# EAGLE schematic SmartCellPrototype (EAGLE 7.1.0)
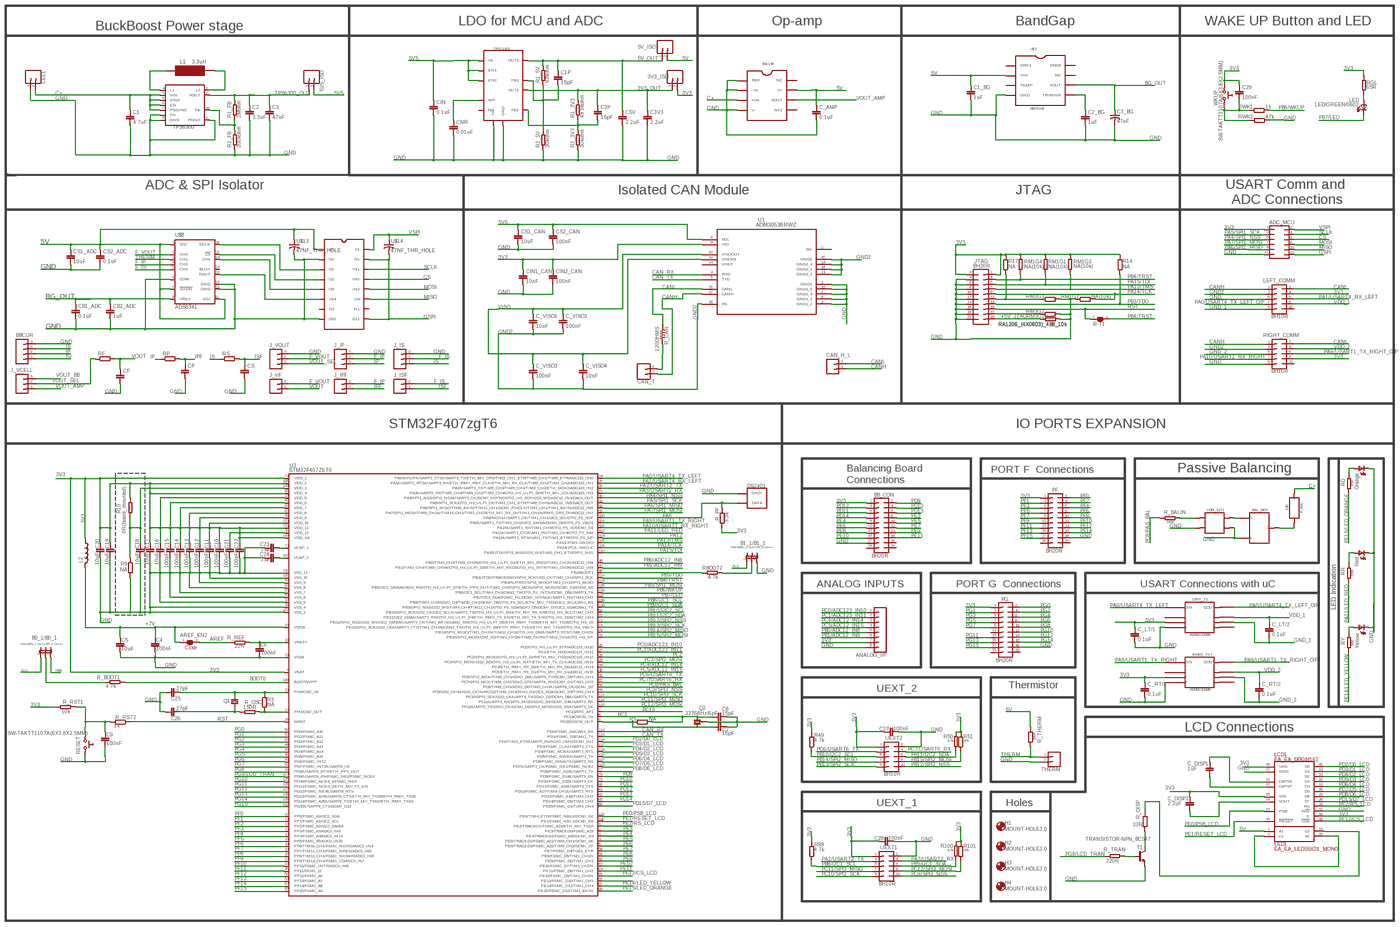
[diagram p0: schematic, sheet 1, overview]
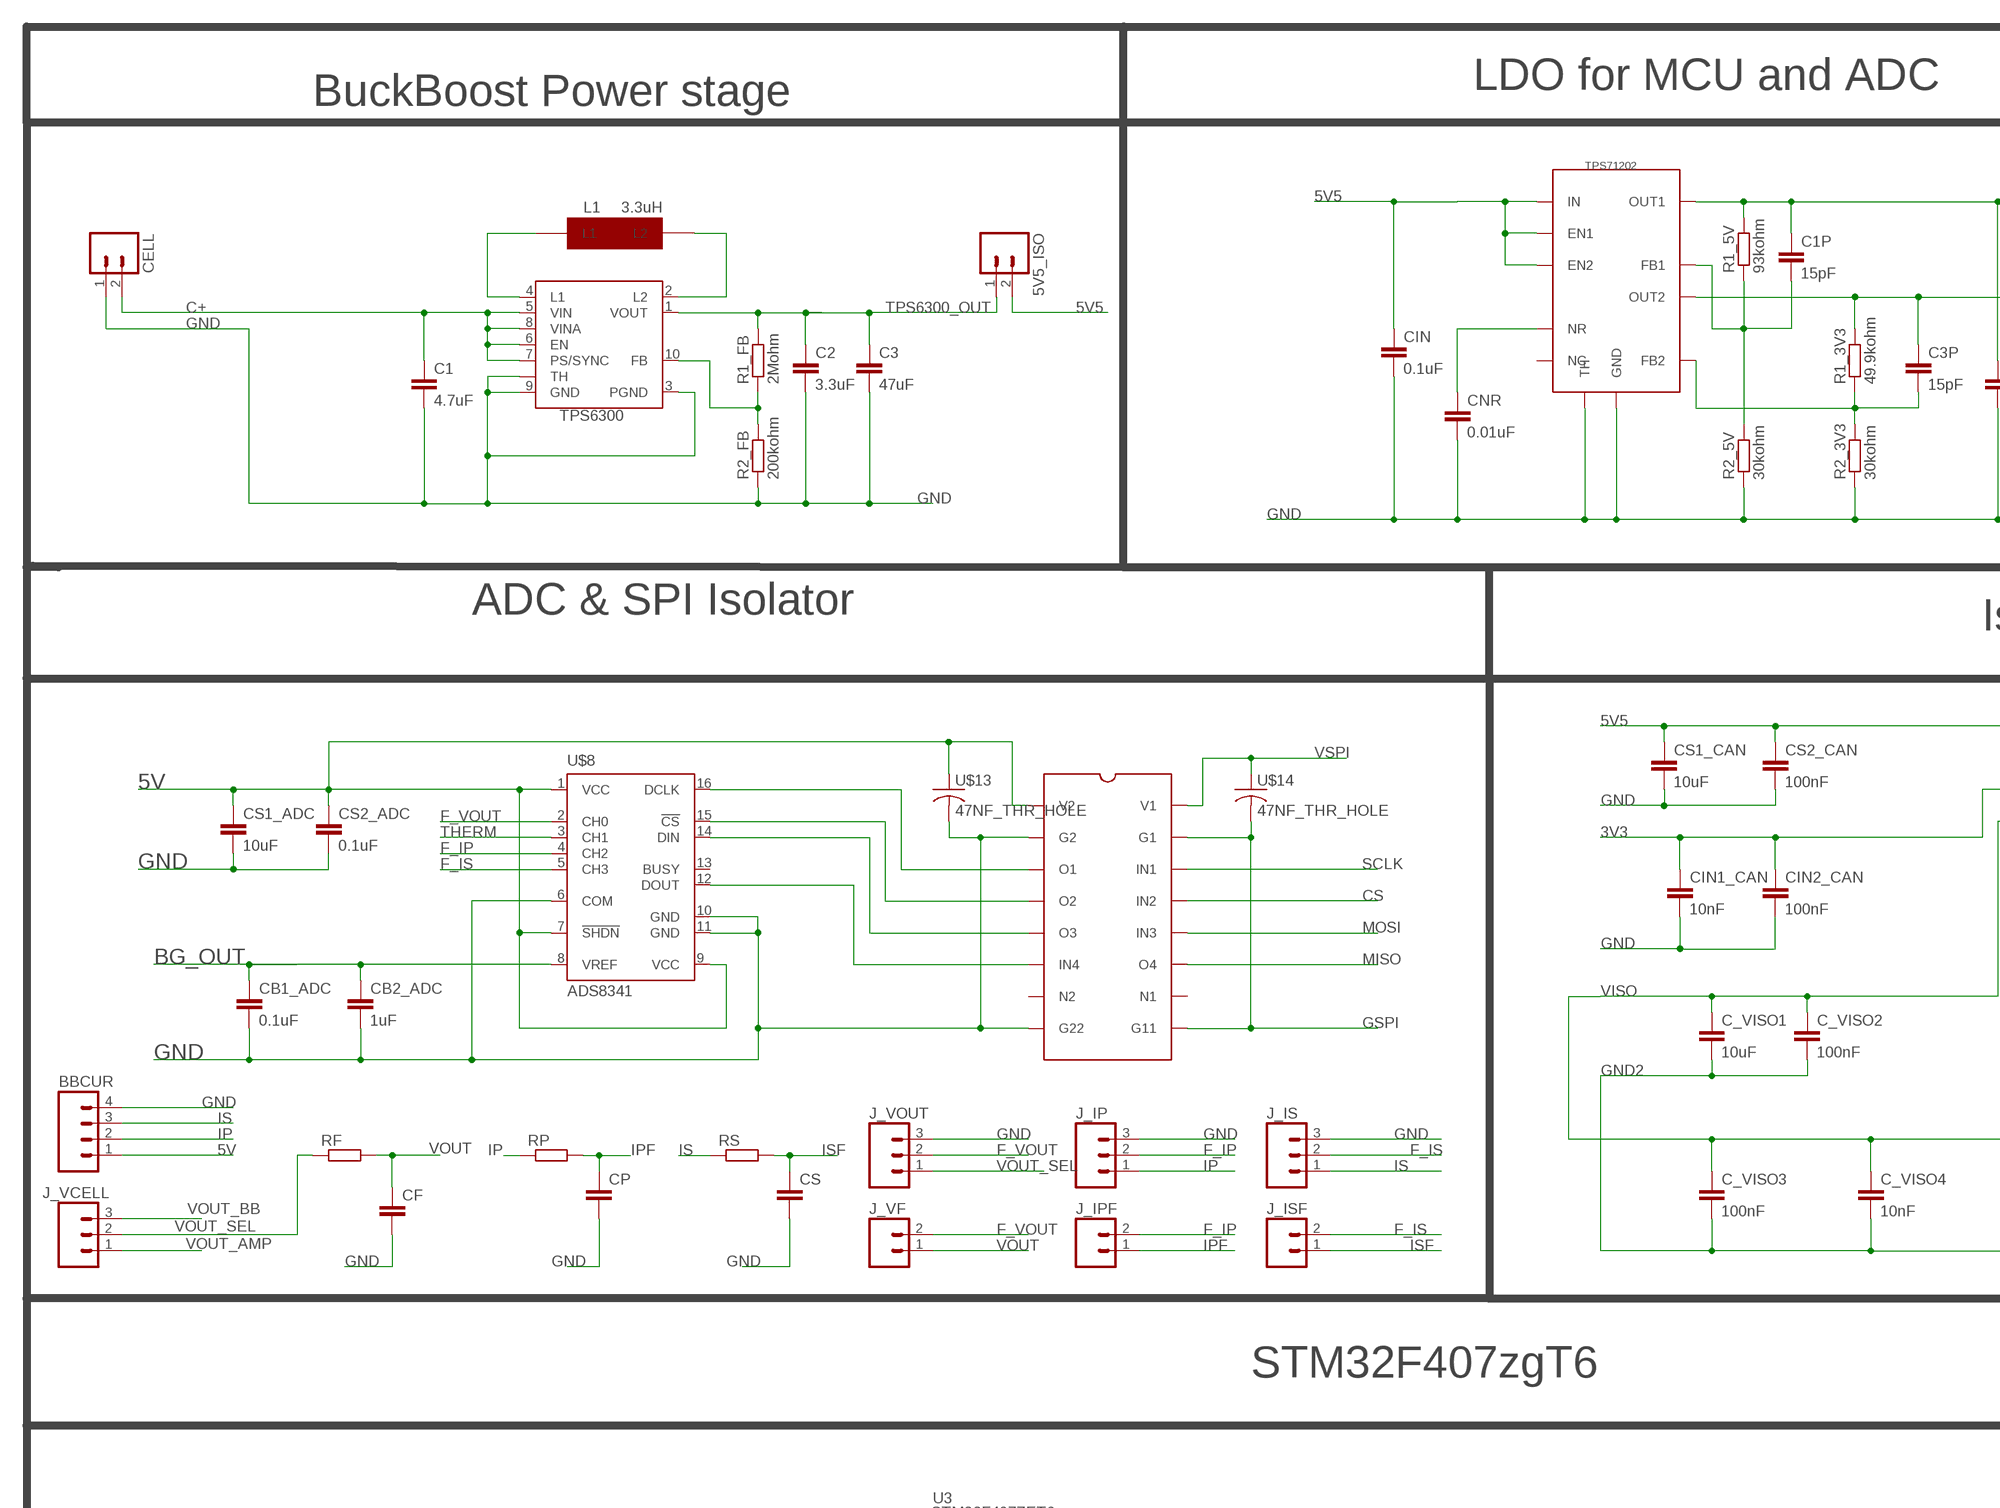
[diagram p1: schematic, sheet 1, part 1 of 4]
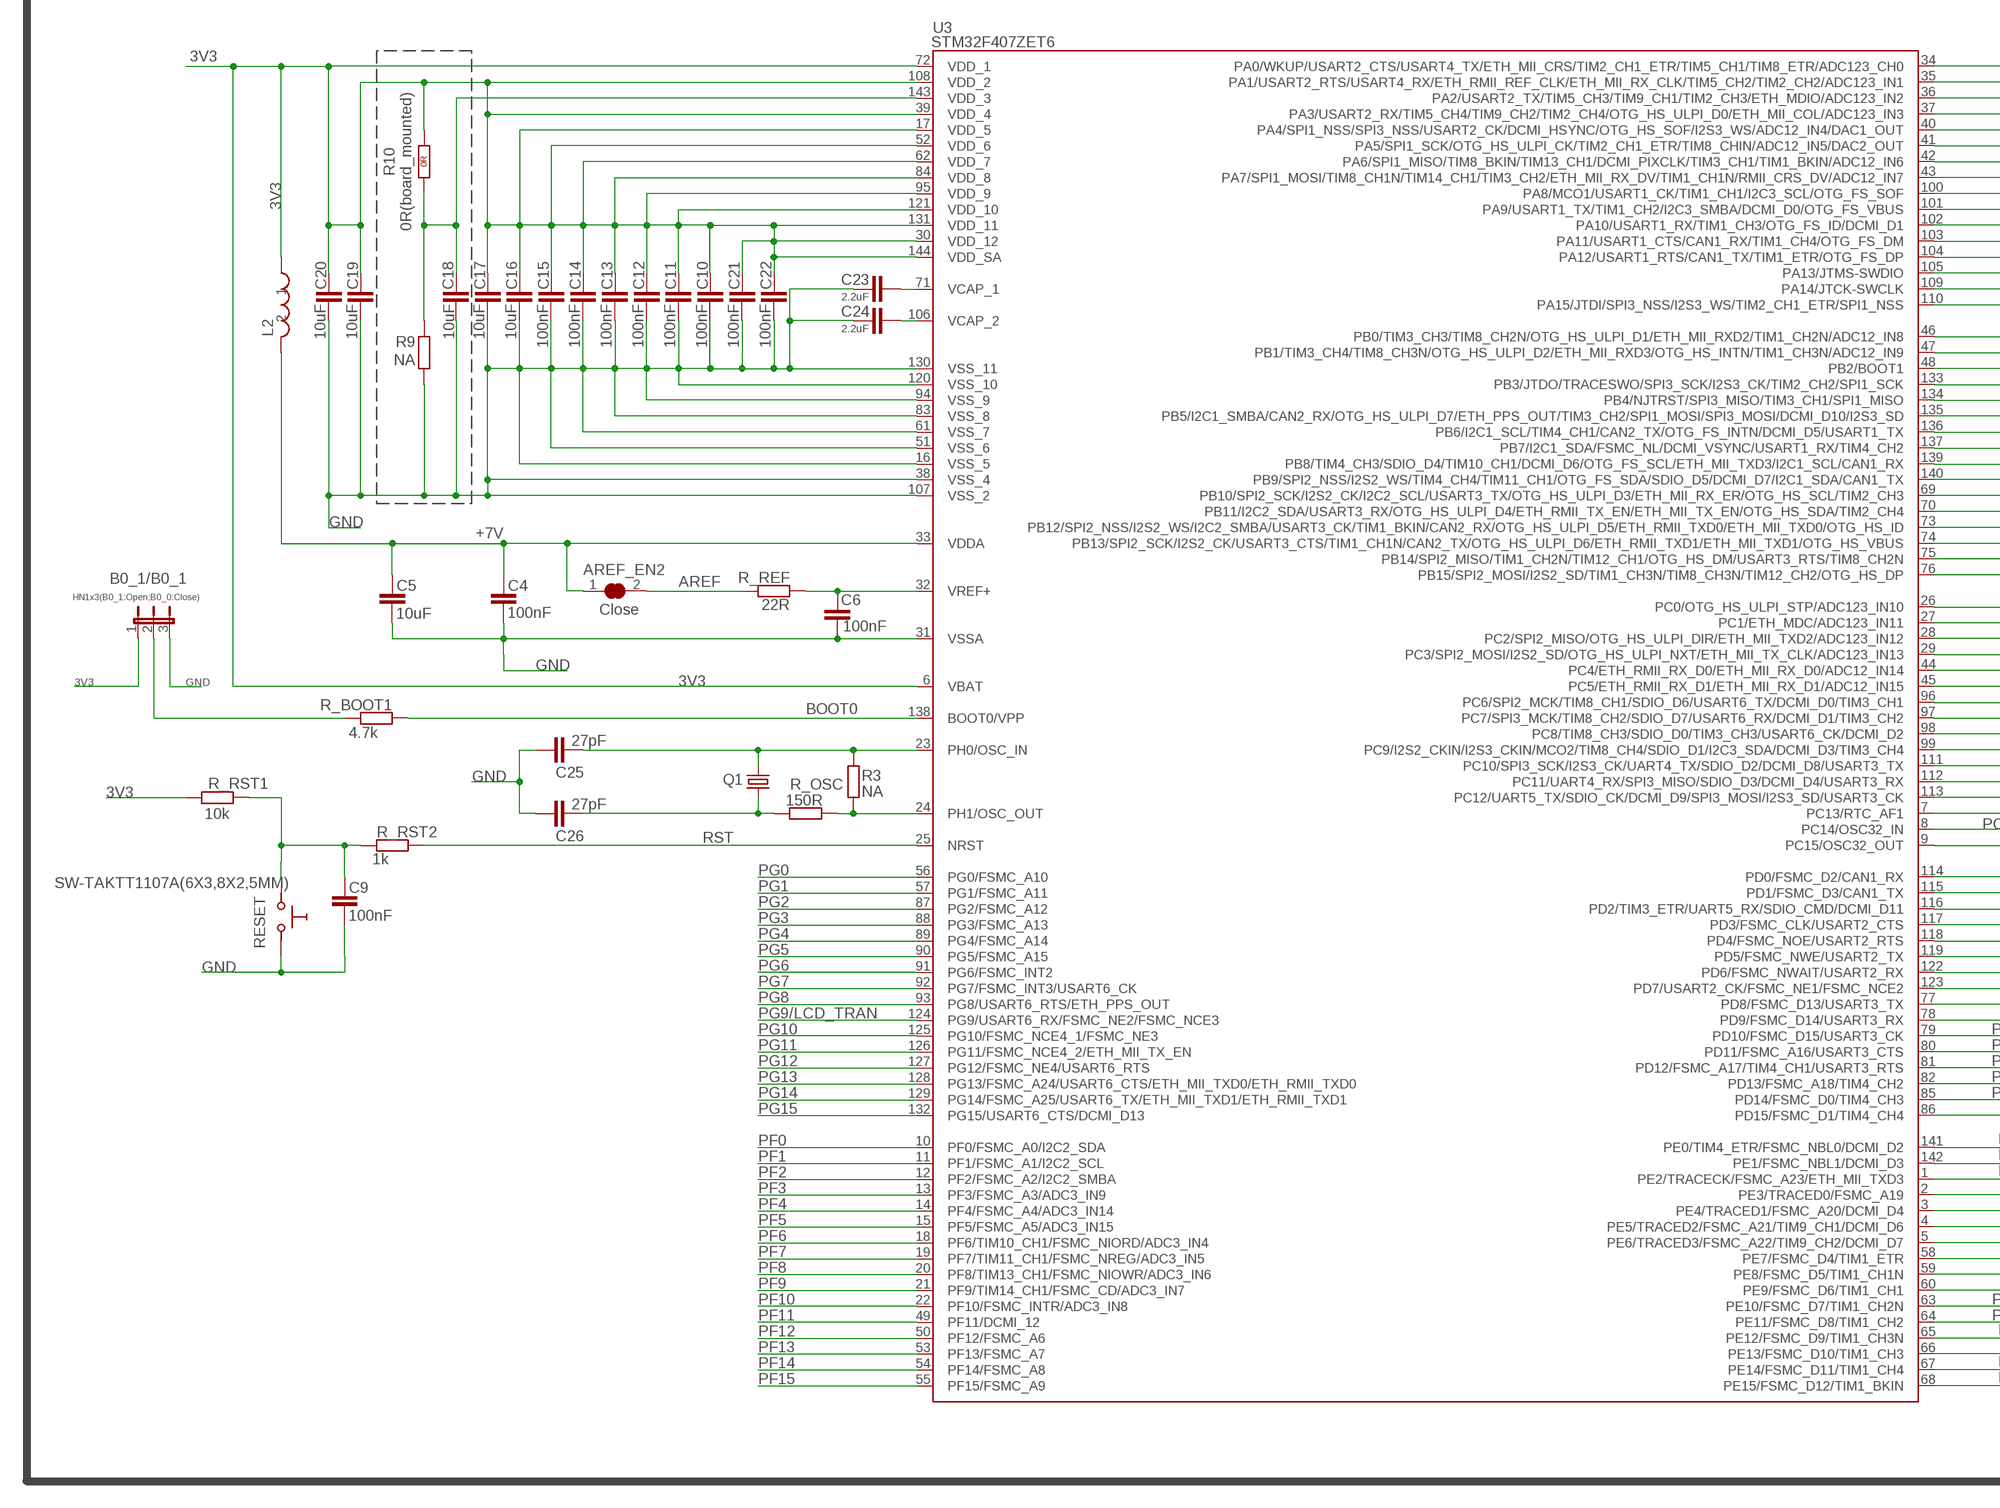
[diagram p2: schematic, sheet 1, part 2 of 4]
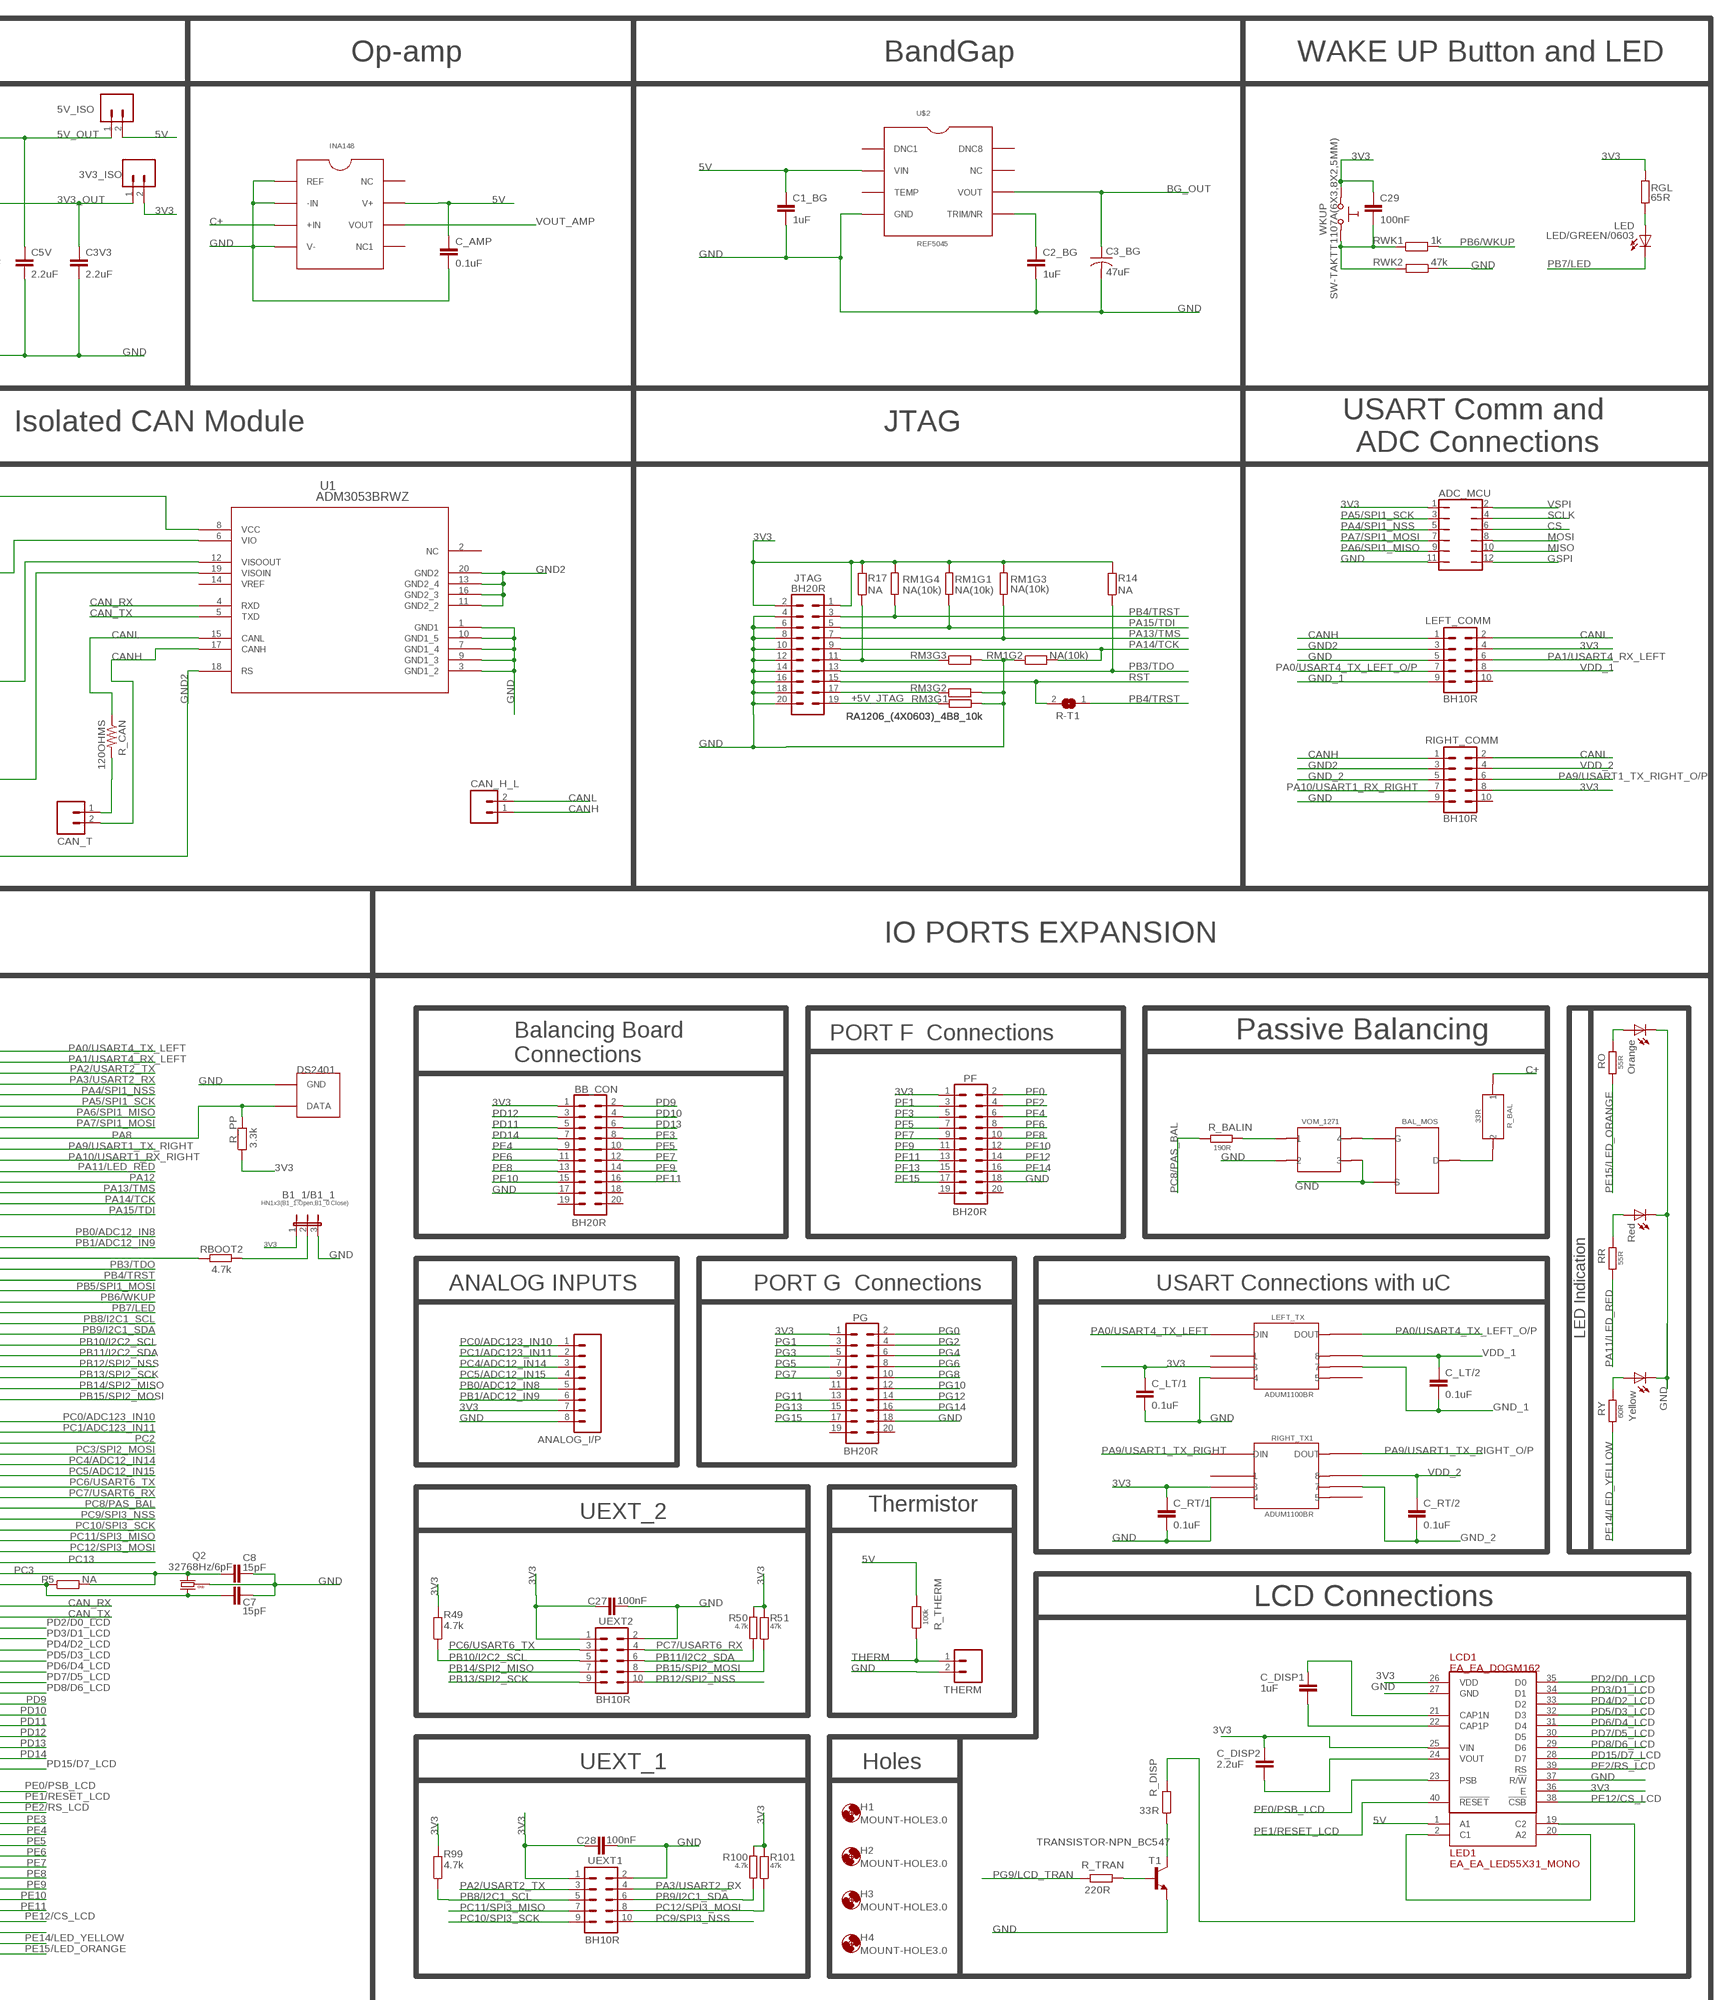
[diagram p3: schematic, sheet 1, part 3 of 4]
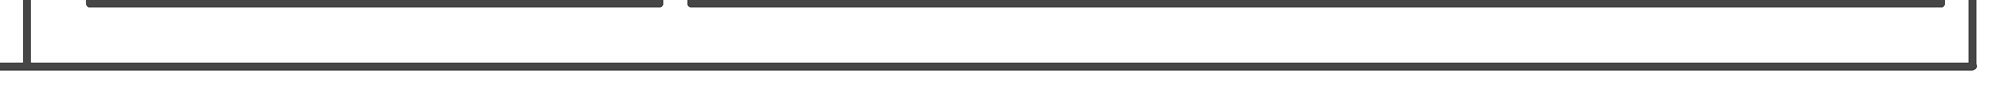
[diagram p4: schematic, sheet 1, part 4 of 4]

## Parts
3V3_ISO  M02PTH  [1X02]
5V5_ISO  M02PTH  [1X02]
5V_ISO  M02PTH  [1X02]
ADC_MCU  JP6Q  [JP6Q]
ANALOG_I/P  M081X08  [1X08]
AREF_EN2  Close  SJSJ_1_SMALLER_CLOSE  [SJ_1_SMALLER_CLOSE]
B0_1/B0_1  HN1x3(B0_1:Open;B0_0:Close)  JP2E  [JP2]
B1_1/B1_1  HN1x3(B1_1:Open;B1_0:Close)  JP2E  [JP2]
BAL_MOS  BAL_MOS  [BAL_MOS]
BB_CON  BH20R  ML20R  [BH20R]
BBCUR  M04PTH  [1X04]
C1  4.7uF  C-EUC0603  [C0603]
C1_BG  1uF  C-EUC0603  [C0603]
C1P  15pF  C-EUC0603  [C0603]
C2  3.3uF  C-EUC0603  [C0603]
C2_BG  1uF  C-EUC0603  [C0603]
C3  47uF  C-EUC0805  [C0805]
C3_BG  47uF  C3_BG  [C3_BG]
C3P  15pF  C-EUC0603  [C0603]
C3V3  2.2uF  C-EUC0603  [C0603]
C4  100nF  C-EUC0603  [C0603]
C5  10uF  C-EUC0603  [C0603]
C5V  2.2uF  C-EUC0603  [C0603]
C6  100nF  C-EUC0603  [C0603]
C7  15pF  C-EUC0603  [C0603]
C8  15pF  C-EUC0603  [C0603]
C9  100nF  C-EUC0603  [C0603]
C10  100nF  C-EUC0603  [C0603]
C11  100nF  C-EUC0603  [C0603]
C12  100nF  C-EUC0603  [C0603]
C13  100nF  C-EUC0603  [C0603]
C14  100nF  C-EUC0603  [C0603]
C15  100nF  C-EUC0603  [C0603]
C16  10uF  C-EUC0603  [C0603]
C17  10uF  C-EUC0603  [C0603]
C18  10uF  C-EUC0603  [C0603]
C19  10uF  C-EUC0603  [C0603]
C20  10uF  C-EUC0603  [C0603]
C21  100nF  C-EUC0603  [C0603]
C22  100nF  C-EUC0603  [C0603]
C23  2.2uF  C-EUC0603  [C0603]
C24  2.2uF  C-EUC0603  [C0603]
C25  27pF  C-EUC0603  [C0603]
C26  27pF  C-EUC0603  [C0603]
C27  100nF  C-EUC0603  [C0603]
C28  100nF  C-EUC0603  [C0603]
C29  100nF  C-EUC0805  [C0805]
C_AMP  0.1uF  C-EUC0603  [C0603]
C_DISP1  1uF  C-EUC0603  [C0603]
C_DISP2  2.2uF  C-EUC0603  [C0603]
C_LT/1  0.1uF  C-EUC0603  [C0603]
C_LT/2  0.1uF  C-EUC0603  [C0603]
C_RT/1  0.1uF  C-EUC0603  [C0603]
C_RT/2  0.1uF  C-EUC0603  [C0603]
C_VISO1  10uF  C-EUC0603  [C0603]
C_VISO2  100nF  C-EUC0603  [C0603]
C_VISO3  100nF  C-EUC0603  [C0603]
C_VISO4  10nF  C-EUC0603  [C0603]
CAN_H_L  M02PTH  [1X02]
CAN_T  M02PTH  [1X02]
CB1_ADC  0.1uF  C-EUC0603  [C0603]
CB2_ADC  1uF  C-EUC0603  [C0603]
CELL  M023.5MM  [SCREWTERMINAL-3.5MM-2]
CF  C-EUC0603  [C0603]
CIN  0.1uF  C-EUC0603  [C0603]
CIN1_CAN  10nF  C-EUC0603  [C0603]
CIN2_CAN  100nF  C-EUC0603  [C0603]
CNR  0.01uF  C-EUC0603  [C0603]
CP  C-EUC0603  [C0603]
CS  C-EUC0603  [C0603]
CS1_ADC  10uF  C-EUC0603  [C0603]
CS1_CAN  10uF  C-EUC0603  [C0603]
CS2_ADC  0.1uF  C-EUC0603  [C0603]
CS2_CAN  100nF  C-EUC0603  [C0603]
DS2401  DS2401  [DS2401]
H1  MOUNT-HOLE3.0  [3,0]
H2  MOUNT-HOLE3.0  [3,0]
H3  MOUNT-HOLE3.0  [3,0]
H4  MOUNT-HOLE3.0  [3,0]
HCPL092J-00E  HCPL902  [HCPL902]
IC1  TPS6300  [DRC-S-PVSON-N10]
INA148  INA148  [INA148]
J_IP  M03PTH  [1X03]
J_IPF  M02PTH  [1X02]
J_IS  M03PTH  [1X03]
J_ISF  M02PTH  [1X02]
J_VCELL  M03PTH  [1X03]
J_VF  M02PTH  [1X02]
J_VOUT  M03PTH  [1X03]
JTAG  BH20R  ML20R  [BH20R]
L1  3.3uH  IND_COILCRAFT3.3UH  [IND_COILCRAFT3.3UH]
L2  FERRITE_BEAD  [FERRITE_BEAD]
LCD1  EA_EA_DOGM162  [EA_EA_DOGM]
LED  LED/GREEN/0603  LED0603DWS  [LED-0603]
LED1  EA_EA_LED55X31_MONO  [EA_EA_LED55X31]
LEFT_COMM  BH10R  ML10R  [BH10R]
LEFT_TX  ADUM1100BR  [R_8]
PF  BH20R  ML20R  [BH20R]
PG  BH20R  ML20R  [BH20R]
Q1  HC49/S2  [HC49/SMD2]
Q2  32768Hz/6pF  Q_GND1  [TC26H_3_REPAIR_SMD]
R1_3V3  49.9kohm  R-EU_R0603  [R0603]
R1_5V  93kohm  R-EU_R0603  [R0603]
R1_FB  2Mohm  R-EU_R0603  [R0603]
R2_3V3  30kohm  R-EU_R0603  [R0603]
R2_5V  30kohm  R-EU_R0603  [R0603]
R2_FB  200kohm  R-EU_R0603  [R0603]
R3  NA  R-EU_R0603  [R0603]
R5  NA  R-EU_R0603  [R0603]
R9  NA  R-EU_R0603  [R0603]
R10  0R(board_mounted)  R_0R0R(NA)  [0603_0R]
R14  NA  R-EU_R0603  [R0603]
R17  NA  R-EU_R0603  [R0603]
R49  4.7k  R-EU_R0603  [R0603]
R50  4.7k  R-EU_R0603  [R0603]
R51  47k  R-EU_R0603  [R0603]
R99  4.7k  R-EU_R0603  [R0603]
R100  4.7k  R-EU_R0603  [R0603]
R101  47k  R-EU_R0603  [R0603]
R-T1  Open  SJSJ_SMALLER  [SJ_1_SMALLER]
R_BAL  33R  R_BAL  [R_BAL]
R_BALIN  190R  R-EU_R0603  [R0603]
R_BOOT1  4.7k  R-EU_R0603  [R0603]
R_CAN  120OHMS  [120OHM]
R_DISP  33R  R-EU_R0603  [R0603]
R_OSC  150R  R-EU_R0603  [R0603]
R_PP  3.3k  R-EU_R0603  [R0603]
R_REF  22R  R-EU_R0603  [R0603]
R_RST1  10k  R-EU_R0603  [R0603]
R_RST2  1k  R-EU_R0603  [R0603]
R_THERM  100k  R-EU_R0603  [R0603]
R_TRAN  220R  R-EU_R0603  [R0603]
RBOOT2  4.7k  R-EU_R0603  [R0603]
RESET  SW-TAKTT1107A(6X3,8X2,5MM)  [WS-TAKT_6X3.5_SMD_NOCREAM]
RF  R-EU_R0603  [R0603]
RGL  65R  R-EU_R0603_5MIL_DWS  [R0603_5MIL_DWS]
RIGHT_COMM  BH10R  ML10R  [BH10R]
RIGHT_TX1  ADUM1100BR  [R_8]
RM1  NA(10k)  R_MATRIX_4E  [R_MATRIX_4]
RM3  RA1206_(4X0603)_4B8_10k  R_MATRIX_4E  [R_MATRIX_4]
RO  55R  R-EU_R0603  [R0603]
RP  R-EU_R0603  [R0603]
RR  55R  R-EU_R0603  [R0603]
RS  R-EU_R0603  [R0603]
RWK1  1k  R-EU_R0603_5MIL_DWS  [R0603_5MIL_DWS]
RWK2  47k  R-EU_R0603_5MIL_DWS  [R0603_5MIL_DWS]
RY  60R  R-EU_R0603  [R0603]
T1  TRANSISTOR-NPN_BC547  [TRANSISTOR-NPN_TO92]
THERM  M02JST-PTH-2  [JST-2-PTH]
U1  ADM3053BRWZ  [RW_20]
U3  STM32F407ZET6  STM32F207ZET6  [LQFP144]
U$1  TPS71202  [TPS71202_LDO_ADC_MCU]
U$2  REF5045  [REF5045_BG]
U$3  Yellow  LED_0805  [LED_0805]
U$4  Red  LED_0805  [LED_0805]
U$5  Orange  LED_0805  [LED_0805]
U$8  ADS8341  [ADS8341]
U$13  47NF_THR_HOLE  [47NF_THR_HOLE]
U$14  47NF_THR_HOLE  [47NF_THR_HOLE]
UEXT1  BH10R  ML10R  [BH10R]
UEXT2  BH10R  ML10R  [BH10R]
VOM_1271  VOM1271  [VOM1271]
WKUP  SW-TAKTT1107A(6X3,8X2,5MM)  [WS-TAKT_6X3.5_SMD_NOCREAM]

## Nets
3V3: 3V3_ISO.2 ADC_MCU.1 ANALOG_I/P.7 B0_1/B0_1.1 B1_1/B1_1.1 BB_CON.1 C10.2 C11.2 C12.2 C13.2 C14.2 C15.2 C16.2 C17.2 C19.2 C20.2 C21.2 C22.2 C27.2 C28.2 C29.2 C_DISP2.1 C_LT/1.1 C_RT/1.1 CIN1_CAN.1 CIN2_CAN.1 JTAG.1 JTAG.2 L2.1 LCD1.25(VIN) LCD1.26(VDD) LCD1.36(E) LEFT_COMM.4 LEFT_TX.3 PF.1 PG.1 R10.2(1.2) R14.2 R17.2 R49.2 R50.2 R51.2 R99.2 R100.2 R101.2 R_PP.1 R_RST1.2 RGL.2 RIGHT_COMM.8 RIGHT_TX1.3 RM1.1.2 RM1.3.2 RM1.4.2 U1.6(VIO) U3.6(VBAT) U3.17(VDD_5) U3.30(VDD_12) U3.39(VDD_4) U3.52(VDD_6) U3.62(VDD_7) U3.72(VDD_1) U3.84(VDD_8) U3.95(VDD_9) U3.108(VDD_2) U3.121(VDD_10) U3.131(VDD_11) U3.144(VDD_SA) UEXT1.1 UEXT2.1 WKUP.P$1
3V3_OUT: 3V3_ISO.1 C3P.1 C3V3.1 R1_3V3.2 U$1.4(OUT2)
5V: 5V_ISO.2 BBCUR.1 C1_BG.1 C_AMP.1 CS1_ADC.1 CS2_ADC.1 HCPL092J-00E.V2 INA148.V+ LED1.1(A1) R_THERM.2 U$2.VIN U$8.1(VCC) U$8.7(!SHDN) U$8.9(VCC) U$13.1
5V5: 5V5_ISO.2 CIN.1 CS1_CAN.1 CS2_CAN.1 U1.8(VCC) U$1.1(IN) U$1.8(EN2) U$1.10(EN1)
5V_OUT: 5V_ISO.1 C1P.1 C5V.1 R1_5V.2 U$1.3(OUT1)
+5V_JTAG: JTAG.19 RM3.1.1
+7V: AREF_EN2.1 C4.2 C5.1 L2.2 U3.33(VDDA)
AREF: AREF_EN2.2 R_REF.1
BG_OUT: C3_BG.+ CB1_ADC.1 CB2_ADC.1 U$2.VOUT U$8.8(VREF)
BOOT0: R_BOOT1.1 U3.138(BOOT0/VPP)
C+: C1.1 CELL.2 IC1.5(VIN) IC1.6(EN) IC1.7(PS/SYNC) IC1.8(VINA) INA148.+IN R_BAL.1
CAN_RX: U1.4(RXD) U3.114(PD0/FSMC_D2/CAN1_RX)
CAN_TX: U1.5(TXD) U3.115(PD1/FSMC_D3/CAN1_TX)
CANH: CAN_H_L.1 CAN_T.2 LEFT_COMM.1 RIGHT_COMM.1 U1.17(CANH)
CANL: CAN_H_L.2 LEFT_COMM.2 R_CAN.1 RIGHT_COMM.2 U1.15(CANL)
CS: ADC_MCU.6 HCPL092J-00E.IN2
F_IP: J_IP.2 J_IPF.2 U$8.4(CH2)
F_IS: J_IS.2 J_ISF.2 U$8.5(CH3)
F_VOUT: J_VF.2 J_VOUT.2 U$8.2(CH0)
GND: ADC_MCU.11 ANALOG_I/P.8 B0_1/B0_1.3 B1_1/B1_1.3 BAL_MOS.S BB_CON.17 BBCUR.4 C1.2 C1_BG.2 C2.2 C2_BG.2 C3.2 C3_BG.- C3V3.2 C4.1 C5.2 C5V.2 C6.1 C7.2 C8.2 C9.1 C10.1 C11.1 C12.1 C13.1 C14.1 C15.1 C16.1 C17.1 C18.1 C19.1 C20.1 C21.1 C22.1 C23.1 C24.1 C25.2 C26.2 C27.1 C28.1 C_AMP.2 C_LT/1.2 C_RT/1.2 CB1_ADC.2 CB2_ADC.2 CELL.1 CF.2 CIN1_CAN.2 CIN2_CAN.2 CIN.2 CNR.2 CP.2 CS1_ADC.2 CS1_CAN.2 CS2_ADC.2 CS2_CAN.2 CS.2 DS2401.GND HCPL092J-00E.G2 HCPL092J-00E.G22 IC1.3(PGND) IC1.9(GND) IC1.TH INA148.-IN INA148.REF INA148.V- J_IP.3 J_IS.3 J_VOUT.3 JTAG.4 JTAG.6 JTAG.8 JTAG.10 JTAG.12 JTAG.14 JTAG.16 JTAG.18 JTAG.20 LCD1.27(GND) LCD1.37(R/!W!) LEFT_COMM.5 LEFT_TX.4 PF.18 PG.18 Q2.GND R2_3V3.1 R2_5V.1 R2_FB.1 R9.2 RESET.P$2 RIGHT_COMM.9 RIGHT_TX1.4 RM1.2.1 RM3.1.2 RM3.2.2 RM3.3.2 RWK2.1 T1.1(E) THERM.2 U1.1(GND1) U1.3(GND1_2) U1.7(GND1_4) U1.9(GND1_3) U1.10(GND1_5) U3.16(VSS_5) U3.31(VSSA) U3.38(VSS_4) U3.51(VSS_6) U3.61(VSS_7) U3.83(VSS_8) U3.94(VSS_9) U3.107(VSS_2) U3.120(VSS_10) U3.130(VSS_11) U$1.5(GND) U$1.TH U$2.GND U$3.K(C) U$4.K(C) U$5.K(C) U$8.6(COM) U$8.10(GND) U$8.11(GND) U$13.2 UEXT1.2 UEXT2.2 VOM_1271.2 VOM_1271.3
GND2: C_VISO1.2 C_VISO2.2 C_VISO3.2 C_VISO4.2 LEFT_COMM.3 RIGHT_COMM.3 U1.11(GND2_2) U1.13(GND2_4) U1.16(GND2_3) U1.18(RS) U1.20(GND2)
GND_1: C_LT/2.2 LEFT_COMM.9 LEFT_TX.7
GND_2: C_RT/2.2 RIGHT_COMM.5 RIGHT_TX1.7
GSPI: ADC_MCU.12 HCPL092J-00E.G1 HCPL092J-00E.G11 U$14.2
IP: BBCUR.2 J_IP.1 RP.1
IPF: CP.1 J_IPF.1 RP.2
IS: BBCUR.3 J_IS.1 RS.1
ISF: CS.1 J_ISF.1 RS.2
MISO: ADC_MCU.10 HCPL092J-00E.OUT4(O4)
MOSI: ADC_MCU.8 HCPL092J-00E.IN3
N$1: IC1.4(L1) L1.L1
N$2: IC1.2(L2) L1.L2
N$3: CAN_T.1 R_CAN.2
N$4: C25.1 Q1.1 R3.2 U3.23(PH0/OSC_IN)
N$5: IC1.10(FB) R1_FB.1 R2_FB.2
N$6: CNR.1 U$1.6(NR)
N$7: C3P.2 R1_3V3.1 R2_3V3.2 U$1.7(FB2)
N$8: R3.1 R_OSC.2 U3.24(PH1/OSC_OUT)
N$9: C2_BG.1 U$2.TRIM/NR
N$10: C1P.2 R1_5V.1 R2_5V.2 U$1.9(FB1)
N$11: B0_1/B0_1.2 R_BOOT1.2
N$12: C9.2 R_RST1.1 R_RST2.2 RESET.P$1
N$13: LED.A RGL.1
N$14: C26.1 Q1.2 R_OSC.1
N$15: BAL_MOS.D R_BAL.2
N$16: BAL_MOS.G VOM_1271.4
N$17: C23.2 U3.71(VCAP_1)
N$18: RY.1 U$3.A
N$19: HCPL092J-00E.IN4 U$8.12(DOUT)
N$21: HCPL092J-00E.OUT3(O3) U$8.14(DIN)
N$22: HCPL092J-00E.OUT2(O2) U$8.15(!CS)
N$23: HCPL092J-00E.OUT1(O1) U$8.16(DCLK)
N$24: C_DISP1.1 LCD1.21(CAP1N)
N$25: C29.1 RWK1.1 RWK2.2 WKUP.P$2
N$26: RR.1 U$4.A
N$27: RBOOT2.1 U3.48(PB2/BOOT1)
N$28: RO.1 U$5.A
N$29: C24.2 U3.106(VCAP_2)
N$30: C_DISP1.2 LCD1.22(CAP1P)
N$31: R_BALIN.2 VOM_1271.1
N$32: C_DISP2.2 LCD1.24(VOUT)
N$33: LED1.2(C1) LED1.20(A2)
N$34: C18.2 R9.1 R10.1(1.1) U3.143(VDD_3)
N$35: B1_1/B1_1.2 RBOOT2.2
N$36: JTAG.11 R17.1 RM3.3.1
N$37: JTAG.17 RM3.2.1
N$38: LED1.19(C2) R_DISP.2
N$39: R_DISP.1 T1.3(C)
N$40: R_TRAN.1 T1.2(B)
N$41: U3.66(PE13/FSMC_D10/TIM1_CH3)
PA0/USART4_TX_LEFT: LEFT_TX.2(DIN) U3.34(PA0/WKUP/USART2_CTS/USART4_TX/ETH_MII_CRS/TIM2_CH1_ETR/TIM5_CH1/TIM8_ETR/ADC123_CH0)
PA0/USART4_TX_LEFT_O/P: LEFT_COMM.7 LEFT_TX.6(DOUT)
PA1/USART4_RX_LEFT: LEFT_COMM.6 U3.35(PA1/USART2_RTS/USART4_RX/ETH_RMII_REF_CLK/ETH_MII_RX_CLK/TIM5_CH2/TIM2_CH2/ADC123_IN1)
PA2/USART2_TX [thin]: U3.36(PA2/USART2_TX/TIM5_CH3/TIM9_CH1/TIM2_CH3/ETH_MDIO/ADC123_IN2) UEXT1.3
PA3/USART2_RX: U3.37(PA3/USART2_RX/TIM5_CH4/TIM9_CH2/TIM2_CH4/OTG_HS_ULPI_D0/ETH_MII_COL/ADC123_IN3) UEXT1.4
PA4/SPI1_NSS: ADC_MCU.5 U3.40(PA4/SPI1_NSS/SPI3_NSS/USART2_CK/DCMI_HSYNC/OTG_HS_SOF/I2S3_WS/ADC12_IN4/DAC1_OUT)
PA5/SPI1_SCK: ADC_MCU.3 U3.41(PA5/SPI1_SCK/OTG_HS_ULPI_CK/TIM2_CH1_ETR/TIM8_CHIN/ADC12_IN5/DAC2_OUT)
PA6/SPI1_MISO: ADC_MCU.9 U3.42(PA6/SPI1_MISO/TIM8_BKIN/TIM13_CH1/DCMI_PIXCLK/TIM3_CH1/TIM1_BKIN/ADC12_IN6)
PA7/SPI1_MOSI: ADC_MCU.7 U3.43(PA7/SPI1_MOSI/TIM8_CH1N/TIM14_CH1/TIM3_CH2/ETH_MII_RX_DV/TIM1_CH1N/RMII_CRS_DV/ADC12_IN7)
PA8: DS2401.DATA R_PP.2 U3.100(PA8/MCO1/USART1_CK/TIM1_CH1/I2C3_SCL/OTG_FS_SOF)
PA9/USART1_TX_RIGHT: RIGHT_TX1.2(DIN) U3.101(PA9/USART1_TX/TIM1_CH2/I2C3_SMBA/DCMI_D0/OTG_FS_VBUS)
PA9/USART1_TX_RIGHT_O/P: RIGHT_COMM.6 RIGHT_TX1.6(DOUT)
PA10/USART1_RX_RIGHT: RIGHT_COMM.7 U3.102(PA10/USART1_RX/TIM1_CH3/OTG_FS_ID/DCMI_D1)
PA11/LED_RED [thin]: RR.2 U3.103(PA11/USART1_CTS/CAN1_RX/TIM1_CH4/OTG_FS_DM)
PA12: U3.104(PA12/USART1_RTS/CAN1_TX/TIM1_ETR/OTG_FS_DP)
PA13/TMS: JTAG.7 RM1.3.1 U3.105(PA13/JTMS-SWDIO)
PA14/TCK: JTAG.9 RM1.2.2 U3.109(PA14/JTCK-SWCLK)
PA15/TDI: JTAG.5 RM1.1.1 U3.110(PA15/JTDI/SPI3_NSS/I2S3_WS/TIM2_CH1_ETR/SPI1_NSS)
PB0/ADC12_IN8: ANALOG_I/P.5 U3.46(PB0/TIM3_CH3/TIM8_CH2N/OTG_HS_ULPI_D1/ETH_MII_RXD2/TIM1_CH2N/ADC12_IN8)
PB1/ADC12_IN9: ANALOG_I/P.6 U3.47(PB1/TIM3_CH4/TIM8_CH3N/OTG_HS_ULPI_D2/ETH_MII_RXD3/OTG_HS_INTN/TIM1_CH3N/ADC12_IN9)
PB3/TDO: JTAG.13 R14.1 U3.133(PB3/JTDO/TRACESWO/SPI3_SCK/I2S3_CK/TIM2_CH2/SPI1_SCK)
PB4/TRST: JTAG.3 R-T1.1 RM1.4.1 U3.134(PB4/NJTRST/SPI3_MISO/TIM3_CH1/SPI1_MISO)
PB5/SPI1_MOSI: U3.135(PB5/I2C1_SMBA/CAN2_RX/OTG_HS_ULPI_D7/ETH_PPS_OUT/TIM3_CH2/SPI1_MOSI/SPI3_MOSI/DCMI_D10/I2S3_SD)
PB6/WKUP: RWK1.2 U3.136(PB6/I2C1_SCL/TIM4_CH1/CAN2_TX/OTG_FS_INTN/DCMI_D5/USART1_TX)
PB7/LED: LED.C U3.137(PB7/I2C1_SDA/FSMC_NL/DCMI_VSYNC/USART1_RX/TIM4_CH2)
PB8/I2C1_SCL: R99.1 U3.139(PB8/TIM4_CH3/SDIO_D4/TIM10_CH1/DCMI_D6/OTG_FS_SCL/ETH_MII_TXD3/I2C1_SCL/CAN1_RX) UEXT1.5
PB9/I2C1_SDA: R100.1 U3.140(PB9/SPI2_NSS/I2S2_WS/TIM4_CH4/TIM11_CH1/OTG_FS_SDA/SDIO_D5/DCMI_D7/I2C1_SDA/CAN1_TX) UEXT1.6
PB10/I2C2_SCL: R49.1 U3.69(PB10/SPI2_SCK/I2S2_CK/I2C2_SCL/USART3_TX/OTG_HS_ULPI_D3/ETH_MII_RX_ER/OTG_HS_SCL/TIM2_CH3) UEXT2.5
PB11/I2C2_SDA: R50.1 U3.70(PB11/I2C2_SDA/USART3_RX/OTG_HS_ULPI_D4/ETH_RMII_TX_EN/ETH_MII_TX_EN/OTG_HS_SDA/TIM2_CH4) UEXT2.6
PB12/SPI2_NSS: U3.73(PB12/SPI2_NSS/I2S2_WS/I2C2_SMBA/USART3_CK/TIM1_BKIN/CAN2_RX/OTG_HS_ULPI_D5/ETH_RMII_TXD0/ETH_MII_TXD0/OTG_HS_ID) UEXT2.10
PB13/SPI2_SCK: U3.74(PB13/SPI2_SCK/I2S2_CK/USART3_CTS/TIM1_CH1N/CAN2_TX/OTG_HS_ULPI_D6/ETH_RMII_TXD1/ETH_MII_TXD1/OTG_HS_VBUS) UEXT2.9
PB14/SPI2_MISO: U3.75(PB14/SPI2_MISO/TIM1_CH2N/TIM12_CH1/OTG_HS_DM/USART3_RTS/TIM8_CH2N) UEXT2.7
PB15/SPI2_MOSI: R51.1 U3.76(PB15/SPI2_MOSI/I2S2_SD/TIM1_CH3N/TIM8_CH3N/TIM12_CH2/OTG_HS_DP) UEXT2.8
PC0/ADC123_IN10: ANALOG_I/P.1 U3.26(PC0/OTG_HS_ULPI_STP/ADC123_IN10)
PC1/ADC123_IN11: ANALOG_I/P.2 U3.27(PC1/ETH_MDC/ADC123_IN11)
PC2: U3.28(PC2/SPI2_MISO/OTG_HS_ULPI_DIR/ETH_MII_TXD2/ADC123_IN12)
PC3: C8.1 Q2.2 R5.2 U3.8(PC14/OSC32_IN)
PC3/SPI2_MOSI: U3.29(PC3/SPI2_MOSI/I2S2_SD/OTG_HS_ULPI_NXT/ETH_MII_TX_CLK/ADC123_IN13)
PC4: C7.1 Q2.1 R5.1 U3.9(PC15/OSC32_OUT)
PC4/ADC12_IN14: ANALOG_I/P.3 U3.44(PC4/ETH_RMII_RX_D0/ETH_MII_RX_D0/ADC12_IN14)
PC5/ADC12_IN15: ANALOG_I/P.4 U3.45(PC5/ETH_RMII_RX_D1/ETH_MII_RX_D1/ADC12_IN15)
PC6/USART6_TX: U3.96(PC6/SPI2_MCK/TIM8_CH1/SDIO_D6/USART6_TX/DCMI_D0/TIM3_CH1) UEXT2.3
PC7/USART6_RX: U3.97(PC7/SPI3_MCK/TIM8_CH2/SDIO_D7/USART6_RX/DCMI_D1/TIM3_CH2) UEXT2.4
PC8/PAS_BAL: R_BALIN.1 U3.98(PC8/TIM8_CH3/SDIO_D0/TIM3_CH3/USART6_CK/DCMI_D2)
PC9/SPI3_NSS: U3.99(PC9/I2S2_CKIN/I2S3_CKIN/MCO2/TIM8_CH4/SDIO_D1/I2C3_SDA/DCMI_D3/TIM3_CH4) UEXT1.10
PC10/SPI3_SCK: U3.111(PC10/SPI3_SCK/I2S3_CK/UART4_TX/SDIO_D2/DCMI_D8/USART3_TX) UEXT1.9
PC11/SPI3_MISO: U3.112(PC11/UART4_RX/SPI3_MISO/SDIO_D3/DCMI_D4/USART3_RX) UEXT1.7
PC12/SPI3_MOSI: R101.1 U3.113(PC12/UART5_TX/SDIO_CK/DCMI_D9/SPI3_MOSI/I2S3_SD/USART3_CK) UEXT1.8
PC13: U3.7(PC13/RTC_AF1)
PD2/D0_LCD: LCD1.35(D0) U3.116(PD2/TIM3_ETR/UART5_RX/SDIO_CMD/DCMI_D11)
PD3/D1_LCD: LCD1.34(D1) U3.117(PD3/FSMC_CLK/USART2_CTS)
PD4/D2_LCD: LCD1.33(D2) U3.118(PD4/FSMC_NOE/USART2_RTS)
PD5/D3_LCD: LCD1.32(D3) U3.119(PD5/FSMC_NWE/USART2_TX)
PD6/D4_LCD: LCD1.31(D4) U3.122(PD6/FSMC_NWAIT/USART2_RX)
PD7/D5_LCD: LCD1.30(D5) U3.123(PD7/USART2_CK/FSMC_NE1/FSMC_NCE2)
PD8/D6_LCD [thin]: LCD1.29(D6) U3.77(PD8/FSMC_D13/USART3_TX)
PD9: BB_CON.2 U3.78(PD9/FSMC_D14/USART3_RX)
PD10: BB_CON.4 U3.79(PD10/FSMC_D15/USART3_CK)
PD11 [thin]: BB_CON.5 U3.80(PD11/FSMC_A16/USART3_CTS)
PD12 [thin]: BB_CON.3 U3.81(PD12/FSMC_A17/TIM4_CH1/USART3_RTS)
PD13: BB_CON.6 U3.82(PD13/FSMC_A18/TIM4_CH2)
PD14: BB_CON.7 U3.85(PD14/FSMC_D0/TIM4_CH3)
PD15/D7_LCD [thin]: LCD1.28(D7) U3.86(PD15/FSMC_D1/TIM4_CH4)
PE0/PSB_LCD: LCD1.23(PSB) U3.141(PE0/TIM4_ETR/FSMC_NBL0/DCMI_D2)
PE1/RESET_LCD [thin]: LCD1.40(!RESET!) U3.142(PE1/FSMC_NBL1/DCMI_D3)
PE2/RS_LCD: LCD1.39(RS) U3.1(PE2/TRACECK/FSMC_A23/ETH_MII_TXD3)
PE3: BB_CON.8 U3.2(PE3/TRACED0/FSMC_A19)
PE4: BB_CON.9 U3.3(PE4/TRACED1/FSMC_A20/DCMI_D4)
PE5: BB_CON.10 U3.4(PE5/TRACED2/FSMC_A21/TIM9_CH1/DCMI_D6)
PE6: BB_CON.11 U3.5(PE6/TRACED3/FSMC_A22/TIM9_CH2/DCMI_D7)
PE7 [thin]: BB_CON.12 U3.58(PE7/FSMC_D4/TIM1_ETR)
PE8 [thin]: BB_CON.13 U3.59(PE8/FSMC_D5/TIM1_CH1N)
PE9: BB_CON.14 U3.60(PE9/FSMC_D6/TIM1_CH1)
PE10: BB_CON.15 U3.63(PE10/FSMC_D7/TIM1_CH2N)
PE11: BB_CON.16 U3.64(PE11/FSMC_D8/TIM1_CH2)
PE12/CS_LCD: LCD1.38(!CSB!) U3.65(PE12/FSMC_D9/TIM1_CH3N)
PE14/LED_YELLOW [thin]: RY.2 U3.67(PE14/FSMC_D11/TIM1_CH4)
PE15/LED_ORANGE [thin]: RO.2 U3.68(PE15/FSMC_D12/TIM1_BKIN)
PF0: PF.2 U3.10(PF0/FSMC_A0/I2C2_SDA)
PF1: PF.3 U3.11(PF1/FSMC_A1/I2C2_SCL)
PF2: PF.4 U3.12(PF2/FSMC_A2/I2C2_SMBA)
PF3: PF.5 U3.13(PF3/FSMC_A3/ADC3_IN9)
PF4: PF.6 U3.14(PF4/FSMC_A4/ADC3_IN14)
PF5 [thin]: PF.7 U3.15(PF5/FSMC_A5/ADC3_IN15)
PF6: PF.8 U3.18(PF6/TIM10_CH1/FSMC_NIORD/ADC3_IN4)
PF7: PF.9 U3.19(PF7/TIM11_CH1/FSMC_NREG/ADC3_IN5)
PF8: PF.10 U3.20(PF8/TIM13_CH1/FSMC_NIOWR/ADC3_IN6)
PF9: PF.11 U3.21(PF9/TIM14_CH1/FSMC_CD/ADC3_IN7)
PF10: PF.12 U3.22(PF10/FSMC_INTR/ADC3_IN8)
PF11: PF.13 U3.49(PF11/DCMI_12)
PF12 [thin]: PF.14 U3.50(PF12/FSMC_A6)
PF13 [thin]: PF.15 U3.53(PF13/FSMC_A7)
PF14 [thin]: PF.16 U3.54(PF14/FSMC_A8)
PF15: PF.17 U3.55(PF15/FSMC_A9)
PG0 [thin]: PG.2 U3.56(PG0/FSMC_A10)
PG1 [thin]: PG.3 U3.57(PG1/FSMC_A11)
PG2: PG.4 U3.87(PG2/FSMC_A12)
PG3: PG.5 U3.88(PG3/FSMC_A13)
PG4 [thin]: PG.6 U3.89(PG4/FSMC_A14)
PG5 [thin]: PG.7 U3.90(PG5/FSMC_A15)
PG6: PG.8 U3.91(PG6/FSMC_INT2)
PG7: PG.9 U3.92(PG7/FSMC_INT3/USART6_CK)
PG8: PG.10 U3.93(PG8/USART6_RTS/ETH_PPS_OUT)
PG9/LCD_TRAN: R_TRAN.2 U3.124(PG9/USART6_RX/FSMC_NE2/FSMC_NCE3)
PG10: PG.12 U3.125(PG10/FSMC_NCE4_1/FSMC_NE3)
PG11: PG.13 U3.126(PG11/FSMC_NCE4_2/ETH_MII_TX_EN)
PG12: PG.14 U3.127(PG12/FSMC_NE4/USART6_RTS)
PG13: PG.15 U3.128(PG13/FSMC_A24/USART6_CTS/ETH_MII_TXD0/ETH_RMII_TXD0)
PG14: PG.16 U3.129(PG14/FSMC_A25/USART6_TX/ETH_MII_TXD1/ETH_RMII_TXD1)
PG15: PG.17 U3.132(PG15/USART6_CTS/DCMI_D13)
RST: JTAG.15 R-T1.2 R_RST2.1 U3.25(NRST)
SCLK: ADC_MCU.4 HCPL092J-00E.IN1
THERM: R_THERM.1 THERM.1 U$8.3(CH1)
TPS6300_OUT: 5V5_ISO.1 C2.1 C3.1 IC1.1(VOUT) R1_FB.2
VDD_1: C_LT/2.1 LEFT_COMM.8 LEFT_TX.8
VDD_2: C_RT/2.1 RIGHT_COMM.4 RIGHT_TX1.8
VISO: C_VISO1.1 C_VISO2.1 C_VISO3.1 C_VISO4.1 U1.12(VISOOUT) U1.19(VISOIN)
VOUT: CF.1 J_VF.1 RF.2
VOUT_AMP: INA148.VOUT J_VCELL.1
VOUT_BB: J_VCELL.3
VOUT_SEL: J_VCELL.2 J_VOUT.1 RF.1
VREF+2: C6.2 R_REF.2 U3.32(VREF+)
VSPI: ADC_MCU.2 HCPL092J-00E.V1 U$14.1
Unconnected: BB_CON.18 BB_CON.19 BB_CON.20 HCPL092J-00E.N1 HCPL092J-00E.N2 INA148.NC INA148.NC1 LEFT_COMM.10 LEFT_TX.1 LEFT_TX.5 PF.19 PF.20 PG.11 PG.19 PG.20 RIGHT_COMM.10 RIGHT_TX1.1 RIGHT_TX1.5 RM3.4.1 RM3.4.2 U1.2(NC) U1.14(VREF) U$1.2(NC) U$2.DNC1 U$2.DNC8 U$2.NC U$2.TEMP U$8.13(BUSY)

## Notes on the sheet
- LDO for MCU and ADC | Op-amp | BandGap | WAKE UP Button and LED
- BuckBoost Power stage
- ADC & SPI Isolator
- USART Comm and
   ADC Connections
- Isolated CAN Module | JTAG
- STM32F407zgT6 | IO PORTS EXPANSION
- Passive Balancing
- PORT F  Connections
- Balancing Board 
  Connections
- ANALOG INPUTS | PORT G  Connections | USART Connections with uC
- LED Indication
- UEXT_2 | Thermistor
- LCD Connections
- UEXT_1 | Holes

## Library data of the parts
3V3_ISO 5V5_ISO 5V_ISO CAN_H_L CAN_T CELL J_IPF J_ISF J_VF THERM = SparkFun-Connectors:M02: Header 2 Standard 2-pin 0.1" header. Use with straight break away headers (SKU : PRT-00116), right angle break away headers (PRT-00553), swiss pins (PRT-00743), machine pins (PRT-00117), and female headers (PRT-00115). Molex polarized connector foot print use with SKU : PRT-08233 with associated crimp pins and housings.
ADC_MCU = jumper:JP6Q: JUMPER
ANALOG_I/P = SparkFun-Connectors:M08: Header 8 Standard 8-pin 0.1" header. Use with straight break away headers (SKU : PRT-00116), right angle break away headers (PRT-00553), swiss pins (PRT-00743), machine pins (PRT-00117), and female headers (PRT-00115).
AREF_EN2 R-T1 = jumper:SJ: SMD solder JUMPER
B0_1/B0_1 B1_1/B1_1 = jumper:JP2E: JUMPER
BAL_MOS = SmartCellPrototype:BAL_MOS
BB_CON JTAG PF PG = con-harting-ml:ML20: HARTING
BBCUR = SparkFun-Connectors:M04: Header 4 Standard 4-pin 0.1" header. Use with straight break away headers (SKU : PRT-00116), right angle break away headers (PRT-00553), swiss pins (PRT-00743), machine pins (PRT-00117), and female headers (PRT-00115). Molex polarized connector foot print use with SKU : PRT-08231 with associated crimp pins and housings. 1MM SMD Version SKU: PRT-10208
C1 C1_BG C1P C2 C2_BG C3 C3P C3V3 C4 C5 C5V C6-C29 C_AMP C_DISP1 C_DISP2 C_LT/1 C_LT/2 C_RT/1 C_RT/2 C_VISO1-C_VISO4 CB1_ADC CB2_ADC CF CIN CIN1_CAN CIN2_CAN CNR CP CS CS1_ADC CS1_CAN CS2_ADC CS2_CAN = rcl:C-EU: CAPACITOR, European symbol
C3_BG = SmartCellPrototype:C3_BG
DS2401 = SmartCellPrototype:DS2401
H1-H4 = holes:MOUNT-HOLE: MOUNTING HOLE with drill center marker
HCPL092J-00E = hcpl902:HCPL902
IC1 = texas:TPS6300*: HIGH EFFICIENT SINGLE INDUCTOR BUCK-BOOST CONVERTER WITH 1.8-A SWITCHES Source: http://focus.ti.com/lit/ds/symlink/tps63001.pdf; MPN: TPS63000DRCTG4; OC_FARNELL: 1511852; OC_NEWARK: 59M7217
INA148 = SmartCellPrototype:INA148
J_IP J_IS J_VCELL J_VOUT = SparkFun-Connectors:M03: Header 3 Standard 3-pin 0.1" header. Use with straight break away headers (SKU : PRT-00116), right angle break away headers (PRT-00553), swiss pins (PRT-00743), machine pins (PRT-00117), and female headers (PRT-00115). Molex polarized connector foot print use with SKU : PRT-08232 with associated crimp pins and housings.
L1 = SmartCellPrototype:IND_COILCRAFT3.3UH
L2 = SmartCellPrototype:FERRITE_BEAD
LCD1 = Arduino_meets_EA_DOGM081_DOGM162_DOGM163_Rev_A:EA_EA_DOGM162: ELECTRONIC ASSEMBYL GmbH EA DOGM162-A EA DOGM081-A EA DOGM163-A
LED = DOUBLE-SIDE:LED
LED1 = Arduino_meets_EA_DOGM081_DOGM162_DOGM163_Rev_A:EA_EA_LED55X31_MONO
LEFT_COMM RIGHT_COMM UEXT1 UEXT2 = con-harting-ml:ML10: HARTING
LEFT_TX RIGHT_TX1 = SmartCellPrototype:ADUM1100BR; MANUFACTURER_PART_NUMBER: ADUM1100BR; VENDOR: Vendor
Q1 = crystal:HC49/S: CRYSTAL
Q2 = crystal:Q_GND
R1_3V3 R1_5V R1_FB R2_3V3 R2_5V R2_FB R3 R5 R9 R14 R17 R49-R51 R99-R101 R_BALIN R_BOOT1 R_DISP R_OSC R_PP R_REF R_RST1 R_RST2 R_THERM R_TRAN RBOOT2 RF RGL RO RP RR RS RWK1 RWK2 RY = rcl:R-EU_: RESISTOR, European symbol
R10 = OLIMEX_DISCRET:R_0R
R_BAL = SmartCellPrototype:R_BAL
R_CAN = SmartCellPrototype:120OHMS
RESET WKUP = gogo:SW-TAKT
RM1 RM3 = OLIMEX_DISCRET:R_MATRIX_4E
T1 = Arduino_meets_EA_DOGM081_DOGM162_DOGM163_Rev_A:TRANSISTOR-NPN_BC547: NPN TRANSISTOR
U1 = SmartCellPrototype:ADM3053BRWZ
U3 = OLIMEX_IC:STM32F207ZE: STM32F207ZE ARM-based 32-bit MCU, 150DMIPs, up to 1 MB Flash/128+4KB RAM,USB OTG HS/FS, Ethernet, 17 TIMs, 3 ADCs, 15 comm. interfaces & camera
U$1 = SmartCellPrototype:TPS71202
U$2 = SmartCellPrototype:REF5045
U$3-U$5 = SmartCellPrototype:LED_0805
U$8 = SmartCellPrototype:ADS8341
U$13 U$14 = SmartCellPrototype:47NF_THR_HOLE
VOM_1271 = SmartCellPrototype:VOM1271

## Net classes
2 thin: width 0.025 mm, clearance 0.025 mm